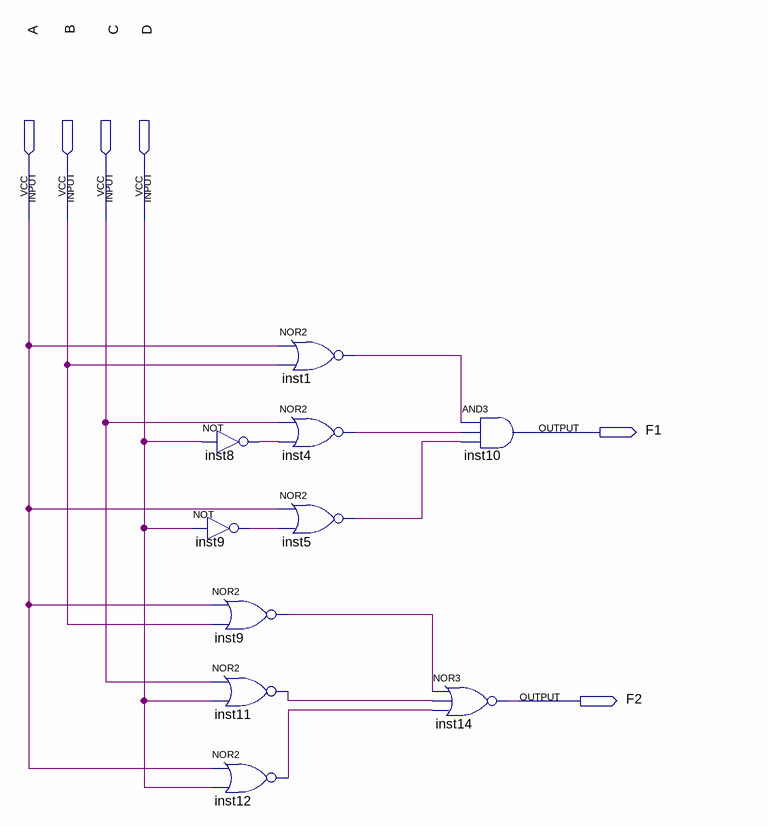
[diagram p0: schematic sheet]
// Quartus schematic HW3P3.bdf as structural Verilog: 10 symbols, 6 pins
module HW3P3 (
  input  A,
  input  B,
  input  C,
  input  D,
  output F1,
  output F2
);

  wire inst1_out, inst4_out, inst5_out, inst8_out, inst9_out, inst9_out_2, inst11_out, inst12_out;

  not inst8 (inst8_out, D);
  not inst9 (inst9_out, D);
  nor inst9_dup2 (inst9_out_2, A, B);
  nor inst11 (inst11_out, C, D);
  nor inst12 (inst12_out, A, D);
  nor inst1 (inst1_out, A, B);
  nor inst4 (inst4_out, C, inst8_out);
  nor inst5 (inst5_out, A, inst9_out);
  and inst10 (F1, inst1_out, inst4_out, inst5_out);
  nor inst14 (F2, inst9_out_2, inst11_out, inst12_out);
endmodule
